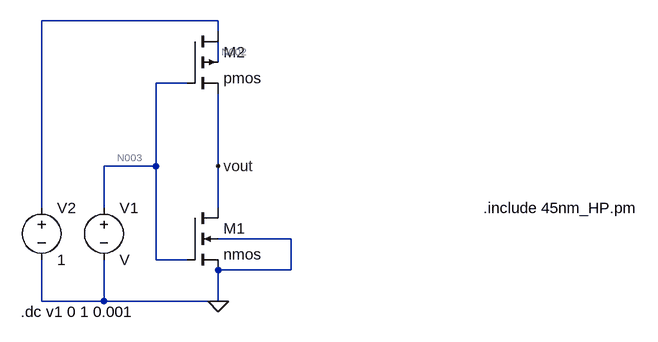
[diagram p0: schematic diffw45_switching.asc]
diffw45_switching.asc, the LTspice schematic file:
Version 4
SHEET 1 1036 680
WIRE 224 -272 -48 -272
WIRE 224 -256 224 -272
WIRE 224 -208 224 -240
WIRE 176 -176 128 -176
WIRE 128 -48 128 -176
WIRE 128 -48 48 -48
WIRE 224 -48 224 -160
WIRE -48 16 -48 -272
WIRE 48 16 48 -48
WIRE 224 16 224 -48
WIRE 336 64 224 64
WIRE 128 96 128 -48
WIRE 176 96 128 96
WIRE 336 112 336 64
WIRE 336 112 224 112
WIRE -48 160 -48 96
WIRE 48 160 48 96
WIRE 48 160 -48 160
WIRE 224 160 224 112
WIRE 224 160 48 160
FLAG 224 -48 vout
FLAG 224 160 0
SYMBOL voltage 48 0 R0
SYMATTR InstName V1
SYMBOL voltage -48 0 R0
WINDOW 123 0 0 Left 0
WINDOW 39 0 0 Left 0
SYMATTR InstName V2
SYMATTR Value 1
SYMBOL cmosp 176 -256 R0
SYMATTR InstName M2
SYMATTR Value pmos
SYMATTR Value2 l=45n w=135n ad=0.0081p as=0.0081p pd=360n ps=360n
SYMBOL cmosn 176 16 R0
SYMATTR InstName M1
SYMATTR Value nmos
SYMATTR Value2 l=45n w=90n
TEXT -80 176 Left 2 !.dc v1 0 1 0.001
TEXT 632 16 Left 2 !.include 45nm_HP.pm

The netlist it stands for:
* diffw45_switching.asc
V1 N003 0 V
V2 N001 0 1
M2 N001 N003 vout N002 pmos l=45n w=135n ad=0.0081p as=0.0081p pd=360n ps=360n
M1 vout N003 0 0 nmos l=45n w=90n
.model NMOS NMOS
.model PMOS PMOS
.lib standard.mos
.dc v1 0 1 0.001
.include 45nm_HP.pm
.backanno
.end

* Results of the author's LTspice run, read from the files saved beside the schematic
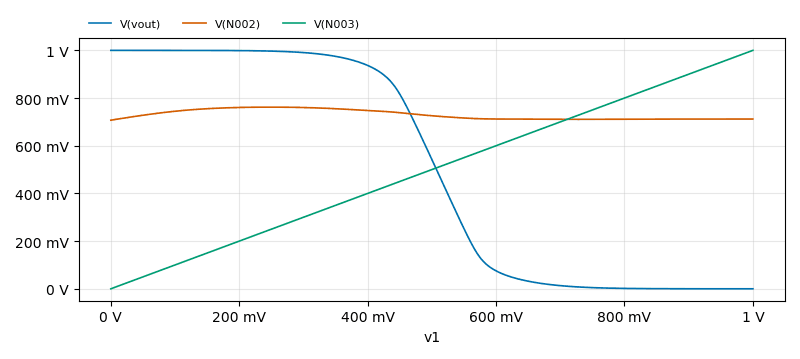
[diagram p1: DC transfer characteristic of diffw45_switching.asc, plotted from the saved traces]
* DC transfer characteristic, 1 run:
*   V(vout): 1 V at v1=0 V, 11.68 µV at v1=1 V, min 11.68 µV, max 1 V
*   V(N002): 707.1 mV at v1=0 V, 712 mV at v1=1 V, min 707.1 mV, max 761.9 mV
*   V(N003): 0 V at v1=0 V, 1 V at v1=1 V, min 0 V, max 1 V